# Altium project analog-switch-replacement-pcb.PrjPcb
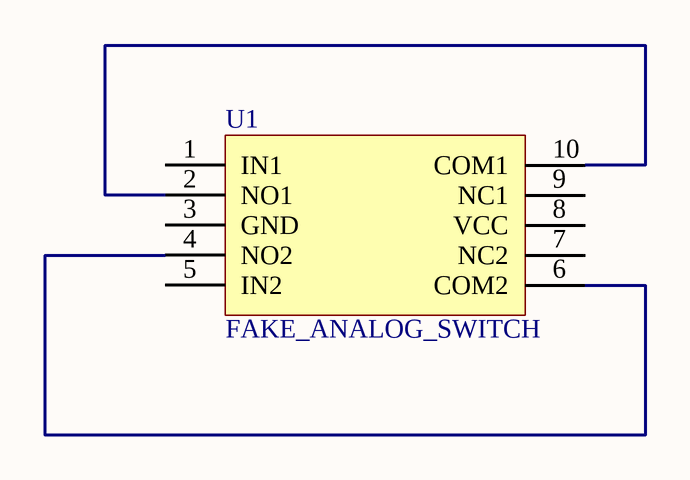
[diagram p0: sch.SchDoc]
1 sheet, 1 parts. Net scope: global (net labels, ports and power ports of the same name join across sheets).
Board files: pcb.PcbDoc, panel.PcbDoc

## Sheet sch.SchDoc
size E; SheetNumber: 1; SheetTotal: 1

### Parts
U1  FAKE_ANALOG_SWITCH  [SMTPCB-SPOOF-UFQFN-10]

### Nets
NetU1_2: U1.2(NO1) U1.10(COM1)
NetU1_4: U1.4(NO2) U1.6(COM2)

Not connected (* = marked no-connect by the designer): U1 1(IN1) 3(GND) 5(IN2) 7(NC2) 8(VCC) 9(NC1)

### Library data of the parts
U1 = FAKE_ANALOG_SWITCH: I MADE A BAD DESIGN CHOICE AND HAVE TO LIVE WITH IT NOW